# Altium project Main.PrjPcb
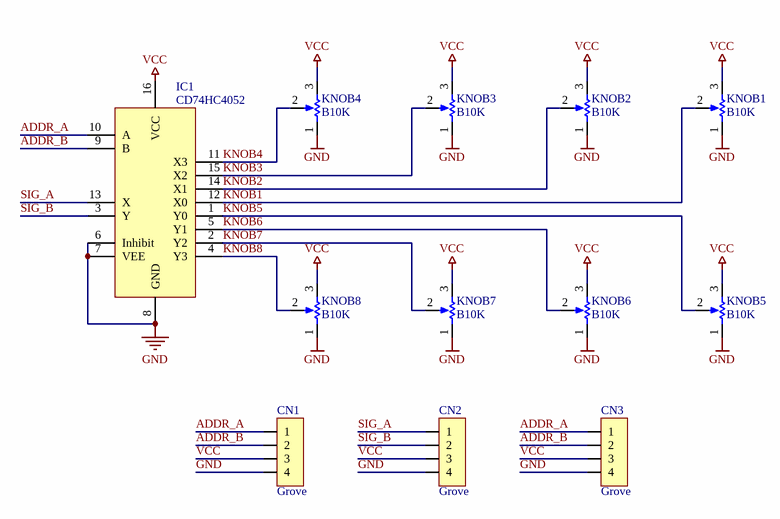
[diagram p0: 01.Main.SchDoc]
1 sheet, 12 parts. Net scope: global (net labels, ports and power ports of the same name join across sheets).
Board file: 00.Main.PcbDoc

## Sheet 01.Main.SchDoc
size A

### Parts
CN1  Grove  [Grove-4P-180D]
CN2  Grove  [Grove-4P-180D]
CN3  Grove  [Grove-4P-180D]
IC1  CD74HC4052  [SOIC16]
KNOB1  B10K  [RV09]
KNOB2  B10K  [RV09]
KNOB3  B10K  [RV09]
KNOB4  B10K  [RV09]
KNOB5  B10K  [RV09]
KNOB6  B10K  [RV09]
KNOB7  B10K  [RV09]
KNOB8  B10K  [RV09]

### Nets
GND: CN1.4 CN2.4 CN3.4 IC1.6(Inhibit) IC1.7(VEE) IC1.8(GND) KNOB1.1 KNOB2.1 KNOB3.1 KNOB4.1 KNOB5.1 KNOB6.1 KNOB7.1 KNOB8.1
VCC: CN1.3 CN2.3 CN3.3 IC1.16(VCC) KNOB1.3 KNOB2.3 KNOB3.3 KNOB4.3 KNOB5.3 KNOB6.3 KNOB7.3 KNOB8.3
ADDR_A: CN1.1 CN3.1 IC1.10(A)
ADDR_B: CN1.2 CN3.2 IC1.9(B)
KNOB1: IC1.12(X0) KNOB1.2
KNOB2: IC1.14(X1) KNOB2.2
KNOB3: IC1.15(X2) KNOB3.2
KNOB4: IC1.11(X3) KNOB4.2
KNOB5: IC1.1(Y0) KNOB5.2
KNOB6: IC1.5(Y1) KNOB6.2
KNOB7: IC1.2(Y2) KNOB7.2
KNOB8: IC1.4(Y3) KNOB8.2
SIG_A: CN2.1 IC1.13(X)
SIG_B: CN2.2 IC1.3(Y)

### Library data of the parts
CN1-CN3 = Connector 1X4
IC1 = TC74HC4052AF
KNOB1-KNOB8 = VR Mono